# Altium schematic sheet LAN.SchDoc
size A4; SheetNumber: 10; SheetTotal: 11
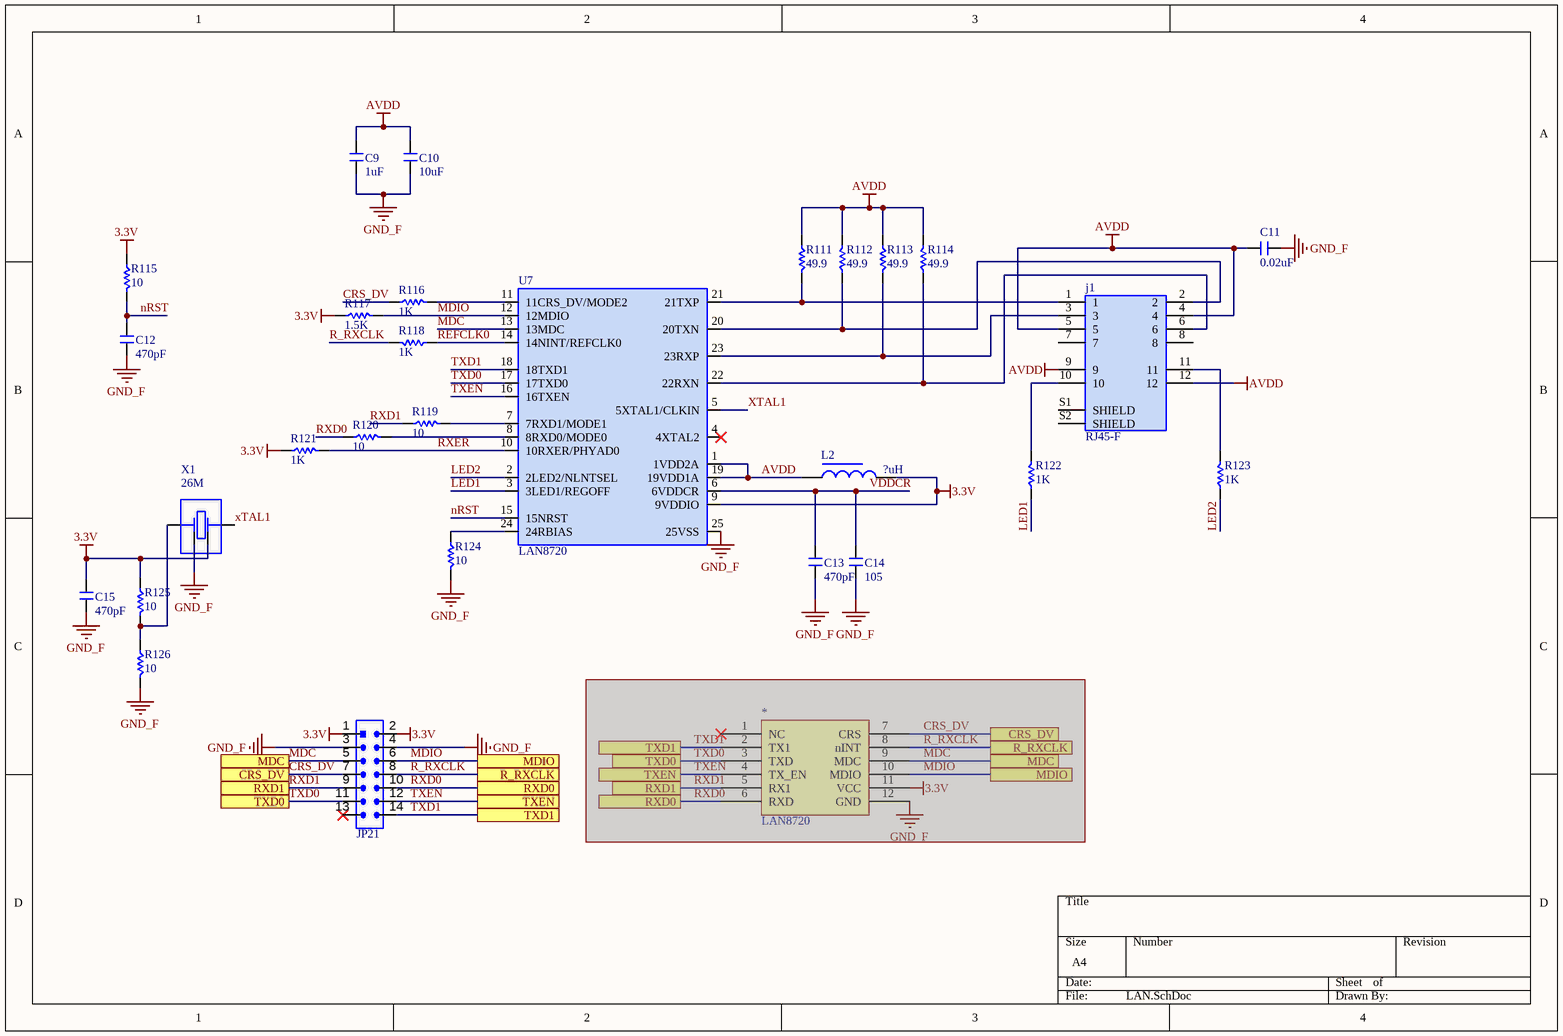
[diagram p0: LAN.SchDoc]

## Parts
*  LAN8720  [LAN8720_module]  (masked out: inside a compile mask, not in the netlist)
C9  1uF  [C 0603]
C10  10uF  [C 0603]
C11  0.02uF  [C 0603]
C12  470pF  [C 0603]
C13  470pF  [C 0603]
C14  105  [C 0603]
C15  470pF  [C 0603]
j1  RJ45-F  [rj45-f]
JP21  Header 2X7  [HDR-7X2]  (value not drawn)
L2  ?uH  [L 0603]
R111  49.9  [R 0603]
R112  49.9  [R 0603]
R113  49.9  [R 0603]
R114  49.9  [R 0603]
R115  10  [R 0603]
R116  1K  [R 0603]
R117  1.5K  [R 0603]
R118  1K  [R 0603]
R119  10  [R 0603]
R120  10  [R 0603]
R121  1K  [R 0603]
R122  1K  [R 0603]
R123  1K  [R 0603]
R124  10  [R 0603]
R125  10  [R 0603]
R126  10  [R 0603]
U7  LAN8720  [LAN8720]
X1  26M  [XTAL-5070-4]

## Ports
CRS_DV, MDC, MDIO, R_RXCLK, RXD0, RXD1, TXD0, TXD1, TXEN

## Nets
3.3V: C15.1 JP21.1 JP21.2 L2.2 R115.1 R117.1 R121.1 R125.1 U7.9(9VDDIO) X1.4
AVDD: C9.1 C10.1 C11.1 j1.4 j1.5 j1.9 j1.12 L2.1 R111.1 R112.2 R113.1 R114.2 U7.1(1VDD2A) U7.19(19VDD1A)
GND_F: C9.2 C10.2 C11.2 C12.1 C13.1 C14.1 C15.2 JP21.3 JP21.4 R124.2 R126.2 U7.25(25VSS) X1.2
CRS_DV: JP21.7 R116.1 ; port CRS_DV
LED1: R122.1 U7.3(3LED1/REGOFF)
LED2: R123.1 U7.2(2LED2/NLNTSEL)
MDC: JP21.5 U7.13(13MDC) ; port MDC
MDIO: JP21.6 R117.2 U7.12(12MDIO) ; port MDIO
nRST: C12.2 R115.2 U7.15(15NRST)
R_RXCLK: JP21.8 R118.2 ; port R_RXCLK
REFCLK0: R118.1 U7.14(14NINT/REFCLK0)
RXD0: JP21.10 R120.1 ; port RXD0
RXD1: JP21.9 R119.1 ; port RXD1
RXER: R121.2 U7.10(10RXER/PHYAD0)
TXD0: JP21.11 U7.17(17TXD0) ; port TXD0
TXD1: JP21.14 U7.18(18TXD1) ; port TXD1
TXEN: JP21.12 U7.16(16TXEN) ; port TXEN
VDDCR: C13.2 C14.2 U7.6(6VDDCR)
XTAL1: U7.5(5XTAL1/CLKIN) X1.3
Netj1_1: j1.1 R111.2 U7.21(21TXP)
Netj1_2: j1.2 R112.1 U7.20(20TXN)
Netj1_3: j1.3 R113.2 U7.23(23RXP)
Netj1_6: j1.6 R114.1 U7.22(22RXN)
Netj1_10: j1.10 R122.2
Netj1_11: j1.11 R123.2
NetR116_2: R116.2 U7.11(11CRS_DV/MODE2)
NetR119_2: R119.2 U7.7(7RXD1/MODE1)
NetR120_2: R120.2 U7.8(8RXD0/MODE0)
NetR124_1: R124.1 U7.24(24RBIAS)
NetR125_2: R125.2 R126.1 X1.1

Not connected (* = marked no-connect by the designer): j1 7 8 S1(SHIELD) S2(SHIELD); JP21 13*; U7 4(4XTAL2)*

## Library data of the parts
C9-C15 = C: Non-polar patch capacitor; BOM名称: 无极性贴片电容; 版权归属: 源创客; 学习资源: www.ooocke.com
JP21 = Header 7X2: 7*2P Connector; BOM名称: 7*2P接插件; 版权归属: 源创客; 学习资源: www.ooocke.com
L2 = L: Low power chip inductor; BOM名称: 小功率贴片电感; 版权归属: 源创客; 学习资源: www.ooocke.com
R111-R126 = R: Chip resistor; 版权归属: 源创客; BOM名称: Chip resistor; 学习资源: www.ooocke.com
X1 = XTAL-4: 4-Pin crystal; BOM名称: 4脚晶振; 版权归属: 源创客; 学习资源: www.ooocke.com